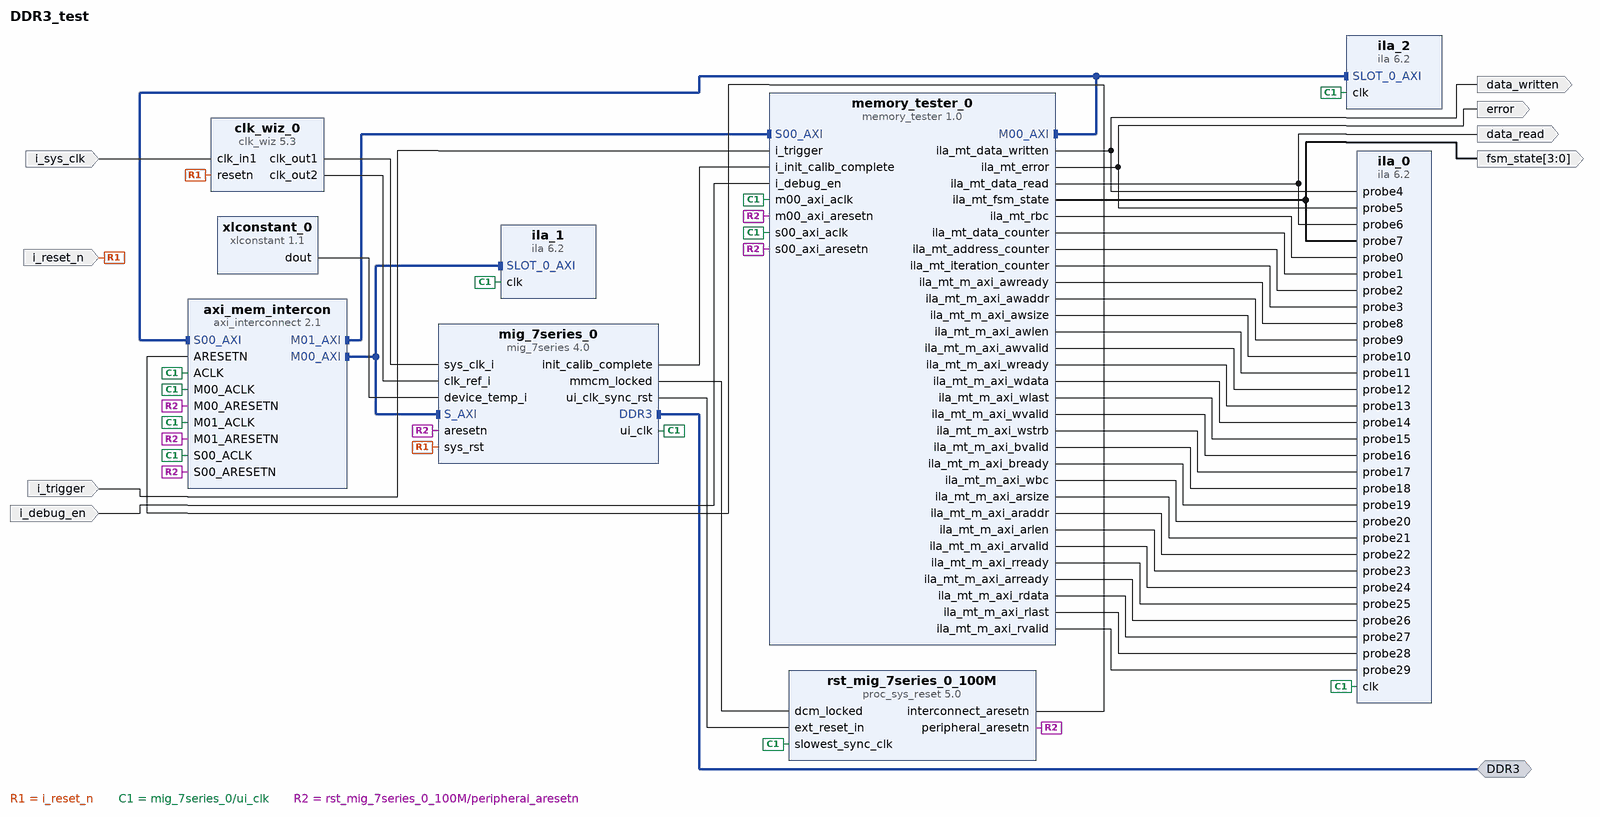
[diagram p0: block diagram of the top level]
# Vivado block design DDR3_test, xc7a200tsbg484-1, Vivado 2016.4
create_bd_design DDR3_test

create_bd_intf_port -mode Master -vlnv xilinx.com:interface:ddrx_rtl:1.0 DDR3
create_bd_port -dir I -type clk i_sys_clk
create_bd_port -dir I -type rst i_reset_n
create_bd_port -dir I i_trigger
create_bd_port -dir I i_debug_en
create_bd_port -dir O data_written
create_bd_port -dir O error
create_bd_port -dir O data_read
create_bd_port -dir O -from 3 -to 0 fsm_state

create_bd_cell -type ip -vlnv xilinx.com:ip:mig_7series:4.0 mig_7series_0
set_property -dict [list \
  CONFIG.XML_INPUT_FILE mig_a.prj \
  CONFIG.RESET_BOARD_INTERFACE Custom \
  CONFIG.BOARD_MIG_PARAM Custom \
] [get_bd_cells mig_7series_0]
create_bd_cell -type ip -vlnv xilinx.com:ip:clk_wiz:5.3 clk_wiz_0
set_property -dict [list \
  CONFIG.CLKOUT2_USED true \
  CONFIG.NUM_OUT_CLKS 2 \
  CONFIG.CLKOUT2_REQUESTED_OUT_FREQ 200.00 \
  CONFIG.RESET_PORT resetn \
  CONFIG.MMCM_DIVCLK_DIVIDE 1 \
  CONFIG.MMCM_CLKOUT1_DIVIDE 5 \
  CONFIG.RESET_TYPE ACTIVE_LOW \
  CONFIG.CLKOUT2_JITTER 114.829 \
  CONFIG.CLKOUT2_PHASE_ERROR 98.575 \
] [get_bd_cells clk_wiz_0]
create_bd_cell -type ip -vlnv xilinx.com:ip:ila:6.2 ila_0
set_property -dict {CONFIG.C_NUM_OF_PROBES 30 CONFIG.C_ENABLE_ILA_AXI_MON false CONFIG.C_MONITOR_TYPE Native} [get_bd_cells ila_0]
create_bd_cell -type ip -vlnv xilinx.com:ip:axi_interconnect:2.1 axi_mem_intercon
set_property -dict {CONFIG.NUM_MI 2} [get_bd_cells axi_mem_intercon]
create_bd_cell -type ip -vlnv xilinx.com:ip:proc_sys_reset:5.0 rst_mig_7series_0_100M
create_bd_cell -type ip -vlnv xilinx.com:ip:xlconstant:1.1 xlconstant_0
set_property -dict {CONFIG.CONST_WIDTH 12} [get_bd_cells xlconstant_0]
create_bd_cell -type ip -vlnv xilinx.com:ip:ila:6.2 ila_1
create_bd_cell -type ip -vlnv xilinx.com:ip:ila:6.2 ila_2
create_bd_cell -type ip -vlnv xilinx.com:user:memory_tester:1.0 memory_tester_0

# ---- connections ----

connect_bd_intf_net [get_bd_intf_pins memory_tester_0/M00_AXI] [get_bd_intf_pins axi_mem_intercon/S00_AXI]
connect_bd_intf_net [get_bd_intf_pins memory_tester_0/M00_AXI] [get_bd_intf_pins ila_2/SLOT_0_AXI]
connect_bd_intf_net [get_bd_intf_pins axi_mem_intercon/M00_AXI] [get_bd_intf_pins mig_7series_0/S_AXI]
connect_bd_intf_net [get_bd_intf_pins axi_mem_intercon/M00_AXI] [get_bd_intf_pins ila_1/SLOT_0_AXI]
connect_bd_intf_net [get_bd_intf_pins axi_mem_intercon/M01_AXI] [get_bd_intf_pins memory_tester_0/S00_AXI]
connect_bd_intf_net [get_bd_intf_ports DDR3] [get_bd_intf_pins mig_7series_0/DDR3]
connect_bd_net [get_bd_pins clk_wiz_0/clk_out1] [get_bd_pins mig_7series_0/sys_clk_i]
connect_bd_net [get_bd_pins clk_wiz_0/clk_out2] [get_bd_pins mig_7series_0/clk_ref_i]
connect_bd_net -net clk_in1_1 [get_bd_ports i_sys_clk] [get_bd_pins clk_wiz_0/clk_in1]
connect_bd_net -net resetn_1 [get_bd_ports i_reset_n] [get_bd_pins clk_wiz_0/resetn] [get_bd_pins mig_7series_0/sys_rst]
connect_bd_net [get_bd_ports i_trigger] [get_bd_pins memory_tester_0/i_trigger]
connect_bd_net [get_bd_ports i_debug_en] [get_bd_pins memory_tester_0/i_debug_en]
connect_bd_net [get_bd_pins mig_7series_0/ui_clk] \
  [get_bd_pins rst_mig_7series_0_100M/slowest_sync_clk] [get_bd_pins ila_0/clk] [get_bd_pins ila_1/clk] \
  [get_bd_pins ila_2/clk] [get_bd_pins axi_mem_intercon/S00_ACLK] [get_bd_pins axi_mem_intercon/ACLK] \
  [get_bd_pins axi_mem_intercon/M00_ACLK] [get_bd_pins axi_mem_intercon/M01_ACLK] [get_bd_pins memory_tester_0/m00_axi_aclk] \
  [get_bd_pins memory_tester_0/s00_axi_aclk]
connect_bd_net [get_bd_pins mig_7series_0/mmcm_locked] [get_bd_pins rst_mig_7series_0_100M/dcm_locked]
connect_bd_net [get_bd_pins mig_7series_0/ui_clk_sync_rst] [get_bd_pins rst_mig_7series_0_100M/ext_reset_in]
connect_bd_net [get_bd_pins rst_mig_7series_0_100M/peripheral_aresetn] \
  [get_bd_pins mig_7series_0/aresetn] [get_bd_pins axi_mem_intercon/S00_ARESETN] [get_bd_pins axi_mem_intercon/M00_ARESETN] \
  [get_bd_pins axi_mem_intercon/M01_ARESETN] [get_bd_pins memory_tester_0/m00_axi_aresetn] \
  [get_bd_pins memory_tester_0/s00_axi_aresetn]
connect_bd_net [get_bd_pins rst_mig_7series_0_100M/interconnect_aresetn] [get_bd_pins axi_mem_intercon/ARESETN]
connect_bd_net [get_bd_pins mig_7series_0/init_calib_complete] [get_bd_pins memory_tester_0/i_init_calib_complete]
connect_bd_net [get_bd_pins memory_tester_0/ila_mt_rbc] [get_bd_pins ila_0/probe0]
connect_bd_net [get_bd_pins memory_tester_0/ila_mt_data_counter] [get_bd_pins ila_0/probe1]
connect_bd_net [get_bd_pins memory_tester_0/ila_mt_address_counter] [get_bd_pins ila_0/probe2]
connect_bd_net [get_bd_pins memory_tester_0/ila_mt_iteration_counter] [get_bd_pins ila_0/probe3]
connect_bd_net [get_bd_pins memory_tester_0/ila_mt_data_written] [get_bd_ports data_written] [get_bd_pins ila_0/probe4]
connect_bd_net [get_bd_pins memory_tester_0/ila_mt_error] [get_bd_ports error] [get_bd_pins ila_0/probe5]
connect_bd_net [get_bd_pins memory_tester_0/ila_mt_data_read] [get_bd_ports data_read] [get_bd_pins ila_0/probe6]
connect_bd_net [get_bd_pins memory_tester_0/ila_mt_fsm_state] [get_bd_ports fsm_state] [get_bd_pins ila_0/probe7]
connect_bd_net [get_bd_pins memory_tester_0/ila_mt_m_axi_awready] [get_bd_pins ila_0/probe8]
connect_bd_net [get_bd_pins memory_tester_0/ila_mt_m_axi_awaddr] [get_bd_pins ila_0/probe9]
connect_bd_net [get_bd_pins memory_tester_0/ila_mt_m_axi_awsize] [get_bd_pins ila_0/probe10]
connect_bd_net [get_bd_pins memory_tester_0/ila_mt_m_axi_awlen] [get_bd_pins ila_0/probe11]
connect_bd_net [get_bd_pins memory_tester_0/ila_mt_m_axi_awvalid] [get_bd_pins ila_0/probe12]
connect_bd_net [get_bd_pins memory_tester_0/ila_mt_m_axi_wready] [get_bd_pins ila_0/probe13]
connect_bd_net [get_bd_pins memory_tester_0/ila_mt_m_axi_wdata] [get_bd_pins ila_0/probe14]
connect_bd_net [get_bd_pins memory_tester_0/ila_mt_m_axi_wlast] [get_bd_pins ila_0/probe15]
connect_bd_net [get_bd_pins memory_tester_0/ila_mt_m_axi_wvalid] [get_bd_pins ila_0/probe16]
connect_bd_net [get_bd_pins memory_tester_0/ila_mt_m_axi_wstrb] [get_bd_pins ila_0/probe17]
connect_bd_net [get_bd_pins memory_tester_0/ila_mt_m_axi_bvalid] [get_bd_pins ila_0/probe18]
connect_bd_net [get_bd_pins memory_tester_0/ila_mt_m_axi_bready] [get_bd_pins ila_0/probe19]
connect_bd_net [get_bd_pins memory_tester_0/ila_mt_m_axi_wbc] [get_bd_pins ila_0/probe20]
connect_bd_net [get_bd_pins memory_tester_0/ila_mt_m_axi_arsize] [get_bd_pins ila_0/probe21]
connect_bd_net [get_bd_pins memory_tester_0/ila_mt_m_axi_araddr] [get_bd_pins ila_0/probe22]
connect_bd_net [get_bd_pins memory_tester_0/ila_mt_m_axi_arlen] [get_bd_pins ila_0/probe23]
connect_bd_net [get_bd_pins memory_tester_0/ila_mt_m_axi_arvalid] [get_bd_pins ila_0/probe24]
connect_bd_net [get_bd_pins memory_tester_0/ila_mt_m_axi_rready] [get_bd_pins ila_0/probe25]
connect_bd_net [get_bd_pins memory_tester_0/ila_mt_m_axi_arready] [get_bd_pins ila_0/probe26]
connect_bd_net [get_bd_pins memory_tester_0/ila_mt_m_axi_rdata] [get_bd_pins ila_0/probe27]
connect_bd_net [get_bd_pins memory_tester_0/ila_mt_m_axi_rlast] [get_bd_pins ila_0/probe28]
connect_bd_net [get_bd_pins memory_tester_0/ila_mt_m_axi_rvalid] [get_bd_pins ila_0/probe29]
connect_bd_net [get_bd_pins xlconstant_0/dout] [get_bd_pins mig_7series_0/device_temp_i]

# ---- address map ----
assign_bd_address -offset 0x44A00000 -range 64K -target_address_space [get_bd_addr_spaces memory_tester_0/M00_AXI] [get_bd_addr_segs memory_tester_0/S00_AXI/S00_AXI_reg]
assign_bd_address -offset 0x80000000 -range 512M -target_address_space [get_bd_addr_spaces memory_tester_0/M00_AXI] [get_bd_addr_segs mig_7series_0/memmap/memaddr]

validate_bd_design
save_bd_design
